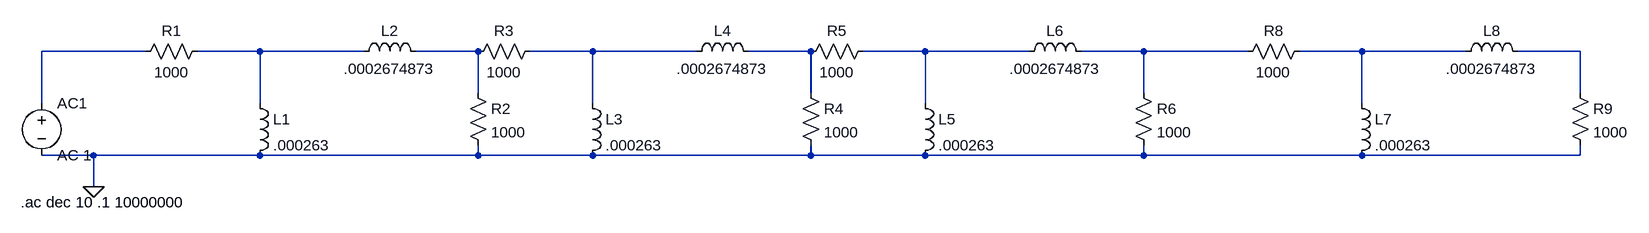
[diagram p0: schematic RL bandpass 4th order.asc]
RL bandpass 4th order.asc, the LTspice schematic file:
Version 4
SHEET 1 2420 680
WIRE 128 0 -32 0
WIRE 304 0 208 0
WIRE 464 0 304 0
WIRE 640 0 544 0
WIRE 816 0 720 0
WIRE 976 0 816 0
WIRE 1152 0 1056 0
WIRE 1328 0 1232 0
WIRE 1488 0 1328 0
WIRE 1664 0 1568 0
WIRE 1824 0 1664 0
WIRE 2000 0 1904 0
WIRE 2160 0 2000 0
WIRE 2336 0 2240 0
WIRE 640 64 640 0
WIRE 1152 64 1152 0
WIRE 1664 64 1664 0
WIRE 2336 64 2336 0
WIRE -32 80 -32 0
WIRE 304 80 304 0
WIRE 816 80 816 0
WIRE 1328 80 1328 0
WIRE 2000 80 2000 0
WIRE 48 160 -32 160
WIRE 304 160 48 160
WIRE 640 160 640 144
WIRE 640 160 304 160
WIRE 816 160 640 160
WIRE 1152 160 1152 144
WIRE 1152 160 816 160
WIRE 1328 160 1152 160
WIRE 1664 160 1664 144
WIRE 1664 160 1328 160
WIRE 2000 160 1664 160
WIRE 2336 160 2336 144
WIRE 2336 160 2000 160
WIRE 48 208 48 160
FLAG 48 208 0
SYMBOL voltage -32 64 R0
SYMATTR InstName AC1
SYMATTR Value AC 1
SYMBOL res 224 -16 R90
WINDOW 0 0 56 VBottom 2
WINDOW 3 32 56 VTop 2
SYMATTR InstName R1
SYMATTR Value 1000
SYMBOL ind 288 64 R0
SYMATTR InstName L1
SYMATTR Value .000263
SYMBOL res 624 48 R0
SYMATTR InstName R2
SYMATTR Value 1000
SYMBOL ind 448 16 R270
WINDOW 0 32 56 VTop 2
WINDOW 3 5 56 VBottom 2
SYMATTR InstName L2
SYMATTR Value .0002674873
SYMBOL res 736 -16 R90
WINDOW 0 0 56 VBottom 2
WINDOW 3 32 56 VTop 2
SYMATTR InstName R3
SYMATTR Value 1000
SYMBOL ind 800 64 R0
SYMATTR InstName L3
SYMATTR Value .000263
SYMBOL res 1136 48 R0
SYMATTR InstName R4
SYMATTR Value 1000
SYMBOL ind 960 16 R270
WINDOW 0 32 56 VTop 2
WINDOW 3 5 56 VBottom 2
SYMATTR InstName L4
SYMATTR Value .0002674873
SYMBOL res 1248 -16 R90
WINDOW 0 0 56 VBottom 2
WINDOW 3 32 56 VTop 2
SYMATTR InstName R5
SYMATTR Value 1000
SYMBOL ind 1312 64 R0
SYMATTR InstName L5
SYMATTR Value .000263
SYMBOL res 1648 48 R0
SYMATTR InstName R6
SYMATTR Value 1000
SYMBOL ind 1472 16 R270
WINDOW 0 32 56 VTop 2
WINDOW 3 5 56 VBottom 2
SYMATTR InstName L6
SYMATTR Value .0002674873
SYMBOL res 1920 -16 R90
WINDOW 0 0 56 VBottom 2
WINDOW 3 32 56 VTop 2
SYMATTR InstName R8
SYMATTR Value 1000
SYMBOL ind 1984 64 R0
SYMATTR InstName L7
SYMATTR Value .000263
SYMBOL res 2320 48 R0
SYMATTR InstName R9
SYMATTR Value 1000
SYMBOL ind 2144 16 R270
WINDOW 0 32 56 VTop 2
WINDOW 3 5 56 VBottom 2
SYMATTR InstName L8
SYMATTR Value .0002674873
TEXT -64 232 Left 2 !.ac dec 10 .1 10000000

The netlist it stands for:
* RL bandpass 4th order.asc
V§AC1 N001 0 AC 1
R1 N002 N001 1000
L1 N002 0 .000263
R2 N003 0 1000
L2 N002 N003 .0002674873
R3 N004 N003 1000
L3 N004 0 .000263
R4 N005 0 1000
L4 N004 N005 .0002674873
R5 N006 N005 1000
L5 N006 0 .000263
R6 N007 0 1000
L6 N006 N007 .0002674873
R8 N008 N007 1000
L7 N008 0 .000263
R9 N009 0 1000
L8 N008 N009 .0002674873
.ac dec 10 .1 10000000
.backanno
.end